# Altium schematic sheet Connector.SchDoc
size A4; Author: Shohei Aoki; Organization: Shokara Inc.; Address1: Yokohama, Japan
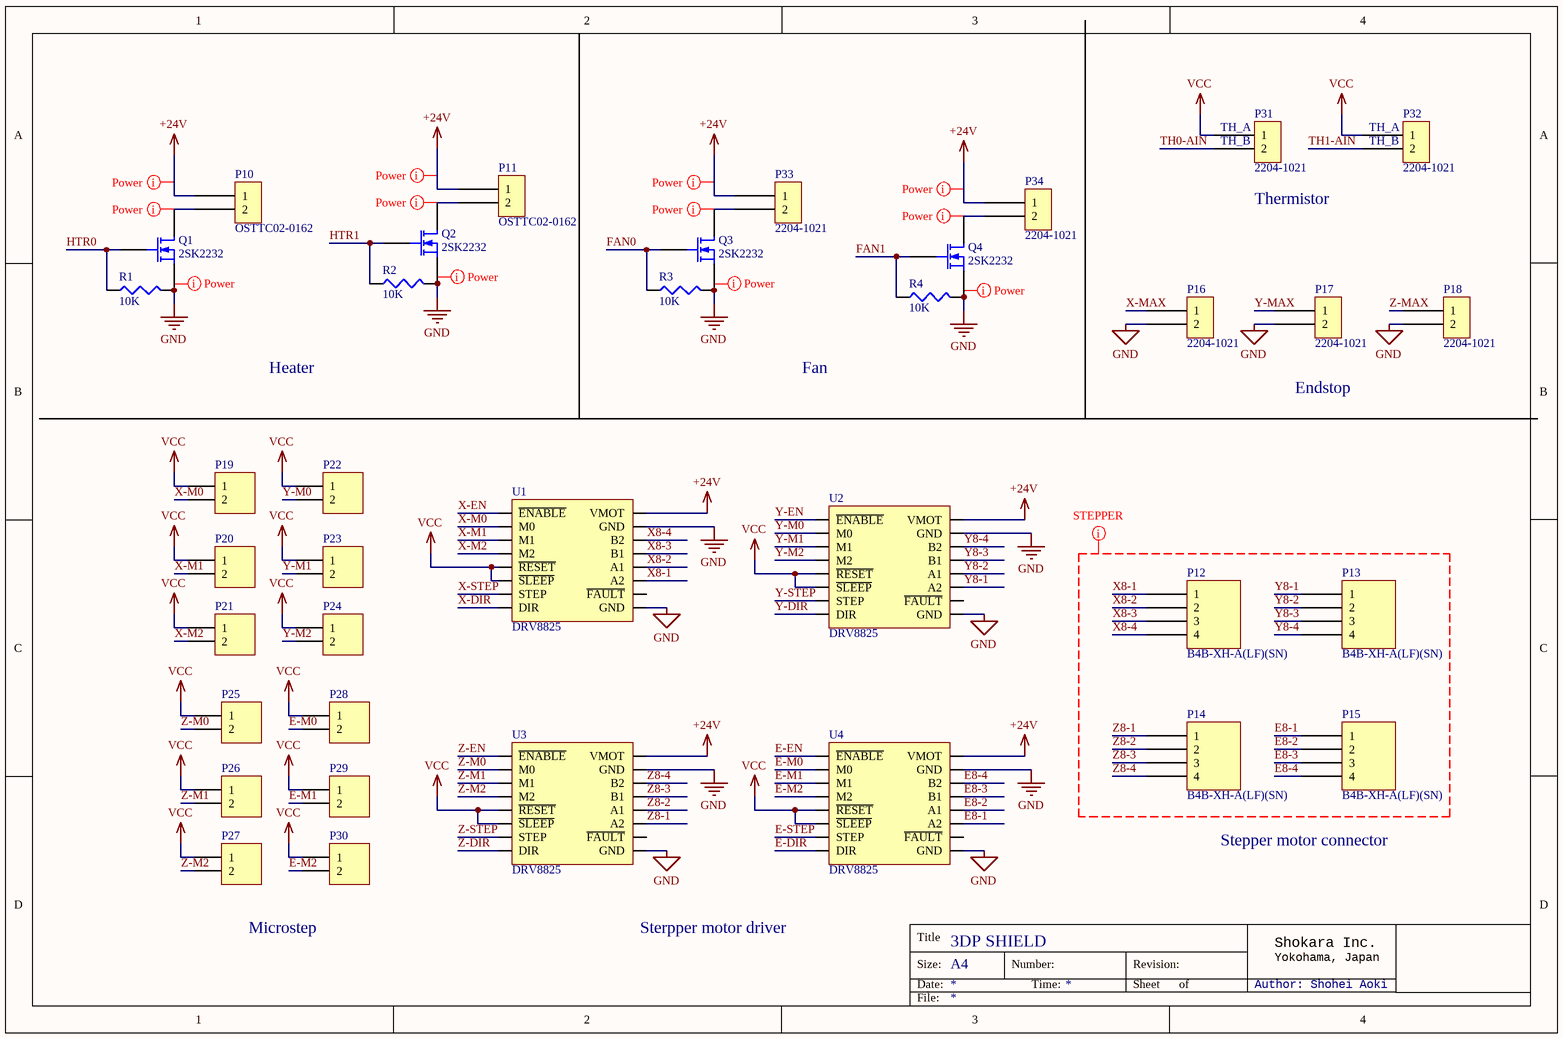
[diagram p0: Connector.SchDoc]

## Parts
P10  OSTTC02-0162  [OSTTC02-0162]
P11  OSTTC02-0162  [OSTTC02-0162]
P12  B4B-XH-A(LF)(SN)  [B4B-XH-A]
P13  B4B-XH-A(LF)(SN)  [B4B-XH-A]
P14  B4B-XH-A(LF)(SN)  [B4B-XH-A]
P15  B4B-XH-A(LF)(SN)  [B4B-XH-A]
P16  2204-1021  [MOLEX_2204_1021]
P17  2204-1021  [MOLEX_2204_1021]
P18  2204-1021  [MOLEX_2204_1021]
P19  Header 2  [HDR1X2]  (value not drawn)
P20  Header 2  [HDR1X2]  (value not drawn)
P21  Header 2  [HDR1X2]  (value not drawn)
P22  Header 2  [HDR1X2]  (value not drawn)
P23  Header 2  [HDR1X2]  (value not drawn)
P24  Header 2  [HDR1X2]  (value not drawn)
P25  Header 2  [HDR1X2]  (value not drawn)
P26  Header 2  [HDR1X2]  (value not drawn)
P27  Header 2  [HDR1X2]  (value not drawn)
P28  Header 2  [HDR1X2]  (value not drawn)
P29  Header 2  [HDR1X2]  (value not drawn)
P30  Header 2  [HDR1X2]  (value not drawn)
P31  2204-1021  [MOLEX_2204_1021]
P32  2204-1021  [MOLEX_2204_1021]
P33  2204-1021  [MOLEX_2204_1021]
P34  2204-1021  [MOLEX_2204_1021]
Q1  2SK2232  [2SK2232]
Q2  2SK2232  [2SK2232]
Q3  2SK2232  [2SK2232]
Q4  2SK2232  [2SK2232]
R1  value 10K  [J1-0603]
R2  value 10K  [J1-0603]
R3  value 10K  [J1-0603]
R4  value 10K  [J1-0603]
U1  DRV8825  [DRV8825]
U2  DRV8825  [DRV8825]
U3  DRV8825  [DRV8825]
U4  DRV8825  [DRV8825]

## Nets
+24V: P10.1 P11.1 P33.1 P34.1 U1.VMOT U2.VMOT U3.VMOT U4.VMOT
GND: P16.2 P17.2 P18.2 Q1.S Q2.S Q3.S Q4.S R1.2 R2.2 R3.2 R4.2 U1.GND U2.GND U3.GND U4.GND
VCC: P19.1 P20.1 P21.1 P22.1 P23.1 P24.1 P25.1 P26.1 P27.1 P28.1 P29.1 P30.1 P31.1 P32.1 U1.RESET(~{RESET}) U1.SLEEP(~{SLEEP}) U2.RESET(~{RESET}) U2.SLEEP(~{SLEEP}) U3.RESET(~{RESET}) U3.SLEEP(~{SLEEP}) U4.RESET(~{RESET}) U4.SLEEP(~{SLEEP})
E8-1: P15.1 U4.A2
E8-2: P15.2 U4.A1
E8-3: P15.3 U4.B1
E8-4: P15.4 U4.B2
E-DIR: U4.DIR
E-EN: U4.ENABLE(~{ENABLE})
E-M0: P28.2 U4.M0
E-M1: P29.2 U4.M1
E-M2: P30.2 U4.M2
E-STEP: U4.STEP
FAN0: Q3.G R3.1
FAN1: Q4.G R4.1
HTR0: Q1.G R1.1
HTR1: Q2.G R2.1
TH0-AIN: P31.2
TH1-AIN: P32.2
X8-1: P12.1 U1.A2
X8-2: P12.2 U1.A1
X8-3: P12.3 U1.B1
X8-4: P12.4 U1.B2
X-DIR: U1.DIR
X-EN: U1.ENABLE(~{ENABLE})
X-M0: P19.2 U1.M0
X-M1: P20.2 U1.M1
X-M2: P21.2 U1.M2
X-MAX: P16.1
X-STEP: U1.STEP
Y8-1: P13.1 U2.A2
Y8-2: P13.2 U2.A1
Y8-3: P13.3 U2.B1
Y8-4: P13.4 U2.B2
Y-DIR: U2.DIR
Y-EN: U2.ENABLE(~{ENABLE})
Y-M0: P22.2 U2.M0
Y-M1: P23.2 U2.M1
Y-M2: P24.2 U2.M2
Y-MAX: P17.1
Y-STEP: U2.STEP
Z8-1: P14.1 U3.A2
Z8-2: P14.2 U3.A1
Z8-3: P14.3 U3.B1
Z8-4: P14.4 U3.B2
Z-DIR: U3.DIR
Z-EN: U3.ENABLE(~{ENABLE})
Z-M0: P25.2 U3.M0
Z-M1: P26.2 U3.M1
Z-M2: P27.2 U3.M2
Z-MAX: P18.1
Z-STEP: U3.STEP
NetP10_2: P10.2 Q1.D
NetP11_2: P11.2 Q2.D
NetP33_2: P33.2 Q3.D
NetP34_2: P34.2 Q4.D

Not connected (* = marked no-connect by the designer): U1 FAULT(~{FAULT}); U2 FAULT(~{FAULT}); U3 FAULT(~{FAULT}); U4 FAULT(~{FAULT})

## Layout directives
net class Stepper: E8-1, E8-2, E8-3, E8-4, X8-1, X8-2, X8-3, X8-4, Y8-1, Y8-2, Y8-3, Y8-4, Z8-1, Z8-2, Z8-3, Z8-4
net class Power: (no net found under the mark), +24V, NetP10_2, NetP11_2, NetP33_2, NetP34_2

## Notes on the sheet
- (near P31) TH_A
- (near P31) TH_B
- (near P32) TH_A
- (near P32) TH_B
- (near P31) Thermistor
- Heater
- Fan
- Endstop
- Stepper motor connector
- Microstep
- Sterpper motor driver
- 3DP SHIELD
- Title
- Size:
- Date:
- A4
- Number:
- Time:
- Revision:
- Sheet
- of
- Author: Shohei Aoki
- Shokara Inc.
- Yokohama, Japan
- File:

## Library data of the parts
P10 P11 = TERMINAL_BLOCK_1X2
P12-P15 = XH_CONNECTOR_1X4
P16-P18 P31-P34 = MOLEX_1X2_HEADER
P19-P30 = Header 2: Header, 2-Pin; LatestRevisionDate: 17-Jul-2002; LatestRevisionNote: Re-released for DXP Platform.; Publisher: Altium Limited
R1-R4 = Res3: Resistor; Published: 8-Jun-2000; LatestRevisionDate: 29-May-2009; LatestRevisionNote: IPC-7351 Footprint Added.; PackageReference: J1-0603; Publisher: Altium Limited; PackageDescription: Chip Resistor